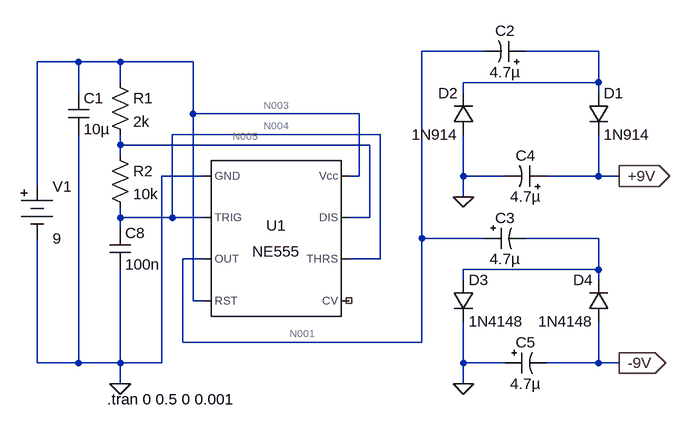
[diagram p0: schematic Modulo-Alimentacion.asc]
Modulo-Alimentacion.asc, the LTspice schematic file:
Version 4
SHEET 1 984 680
WIRE 432 -96 336 -96
WIRE 608 -96 496 -96
WIRE -192 -80 -256 -80
WIRE -128 -80 -192 -80
WIRE -16 -80 -128 -80
WIRE -128 -48 -128 -80
WIRE 608 -48 608 -96
WIRE 608 -48 400 -48
WIRE -192 -32 -192 -80
WIRE 400 -32 400 -48
WIRE 608 -32 608 -48
WIRE -16 0 -16 -80
WIRE 240 0 -16 0
WIRE 272 32 -48 32
WIRE -128 48 -128 32
WIRE 256 48 -128 48
WIRE -128 64 -128 48
WIRE 0 96 -64 96
WIRE 240 96 240 0
WIRE 240 96 224 96
WIRE 400 96 400 32
WIRE 464 96 400 96
WIRE 608 96 608 32
WIRE 608 96 528 96
WIRE 640 96 608 96
WIRE -256 112 -256 -80
WIRE 400 128 400 96
WIRE -128 160 -128 144
WIRE -48 160 -48 32
WIRE -48 160 -128 160
WIRE 0 160 -48 160
WIRE 256 160 256 48
WIRE 256 160 224 160
WIRE -128 176 -128 160
WIRE 336 192 336 -96
WIRE 432 192 336 192
WIRE 608 192 496 192
WIRE 0 224 -32 224
WIRE 272 224 272 32
WIRE 272 224 224 224
WIRE 608 240 608 192
WIRE 608 240 400 240
WIRE 400 256 400 240
WIRE 608 256 608 240
WIRE -16 288 -16 0
WIRE 0 288 -16 288
WIRE -32 352 -32 224
WIRE 336 352 336 192
WIRE 336 352 -32 352
WIRE -256 384 -256 192
WIRE -192 384 -192 32
WIRE -192 384 -256 384
WIRE -128 384 -128 240
WIRE -128 384 -192 384
WIRE -64 384 -64 96
WIRE -64 384 -128 384
WIRE 400 384 400 320
WIRE 464 384 400 384
WIRE 608 384 608 320
WIRE 608 384 528 384
WIRE 640 384 608 384
WIRE -128 416 -128 384
WIRE 400 416 400 384
FLAG -128 416 0
FLAG 400 128 0
FLAG 400 416 0
FLAG 640 96 +9V
IOPIN 640 96 Out
FLAG 640 384 -9V
IOPIN 640 384 Out
SYMBOL Misc\\NE555 112 192 R0
SYMATTR InstName U1
SYMBOL res -144 -64 R0
SYMATTR InstName R1
SYMATTR Value 2k
SYMBOL res -144 48 R0
SYMATTR InstName R2
SYMATTR Value 10k
SYMBOL cap -208 -32 R0
SYMATTR InstName C1
SYMATTR Value 10µ
SYMBOL polcap 496 -80 M270
WINDOW 0 32 32 VTop 2
WINDOW 3 0 32 VBottom 2
SYMATTR InstName C2
SYMATTR Value 4.7µ
SYMBOL polcap 432 176 M90
WINDOW 0 0 32 VBottom 2
WINDOW 3 32 32 VTop 2
SYMATTR InstName C3
SYMATTR Value 4.7µ
SYMBOL polcap 528 112 M270
WINDOW 0 32 32 VTop 2
WINDOW 3 0 32 VBottom 2
SYMATTR InstName C4
SYMATTR Value 4.7µ
SYMBOL polcap 464 368 M90
WINDOW 0 0 32 VBottom 2
WINDOW 3 32 32 VTop 2
SYMATTR InstName C5
SYMATTR Value 4.7µ
SYMBOL diode 592 -32 R0
SYMATTR InstName D1
SYMATTR Value 1N914
SYMBOL diode 416 32 R180
WINDOW 0 24 64 Left 2
WINDOW 3 24 0 Left 2
SYMATTR InstName D2
SYMATTR Value 1N914
SYMBOL diode 384 256 R0
SYMATTR InstName D3
SYMATTR Value 1N4148
SYMBOL diode 624 320 R180
WINDOW 0 24 64 Left 2
WINDOW 3 24 0 Left 2
SYMATTR InstName D4
SYMATTR Value 1N4148
SYMBOL cap -144 176 R0
SYMATTR InstName C8
SYMATTR Value 100n
SYMBOL Misc\\battery -256 96 R0
WINDOW 123 0 0 Left 0
WINDOW 39 0 0 Left 0
SYMATTR InstName V1
SYMATTR Value 9
TEXT -148 440 Left 2 !.tran 0 0.5 0 0.001

The netlist it stands for:
* Modulo-Alimentacion.asc
XU1 0 N004 N001 N003 NC_01 N004 N005 N003 NE555  ; pins GND TRIG OUT RST CV THRS DIS Vcc
R1 N003 N005 2k
R2 N005 N004 10k
C1 N003 0 10µ
C2 N002 N001 4.7µ
C3 N001 N006 4.7µ
C4 +9V 0 4.7µ
C5 0 -9V 4.7µ
D1 N002 +9V 1N914
D2 0 N002 1N914
D3 N006 0 1N4148
D4 -9V N006 1N4148
C8 N004 0 100n
V1 N003 0 9
.model D D
.lib standard.dio
.tran 0 0.5 0 0.001
.lib NE555.sub
.backanno
.end

* Results of the author's LTspice run, read from the files saved beside the schematic
* Operating Point, zero values left out:
*   V(n004) = 9 V
*   V(n003) = 9 V
*   V(n005) = 9 V
*   V(n001) = 9 V
*   I(R2) = 18 nA
*   I(R1) = 30.01 nA
*   I(V1) = -2.908 mA
*   Ix(u1:1) = -2.908 mA
*   Ix(u1:2) = 9 nA
*   Ix(u1:4) = 49.33 µA
*   Ix(u1:6) = 9 nA
*   Ix(u1:7) = 12.01 nA
*   Ix(u1:8) = 2.859 mA
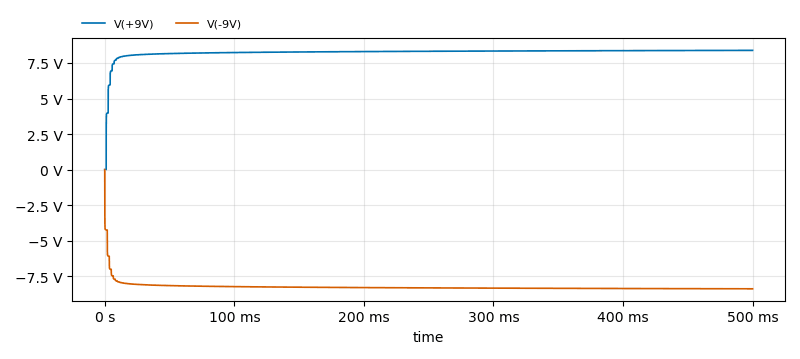
[diagram p1: Transient Analysis of Modulo-Alimentacion.asc, plotted from the saved traces]
* Transient Analysis, 1 run:
*   V(+9V): min -1.002 µV, max 8.389 V, average 8.249 V, rms 8.264 V, last 8.389 V
*   V(-9V): min -8.389 V, max 0 V, average -8.266 V, rms 8.272 V, last -8.389 V